# Altium schematic sheet Ethernet.SchDoc
size A4
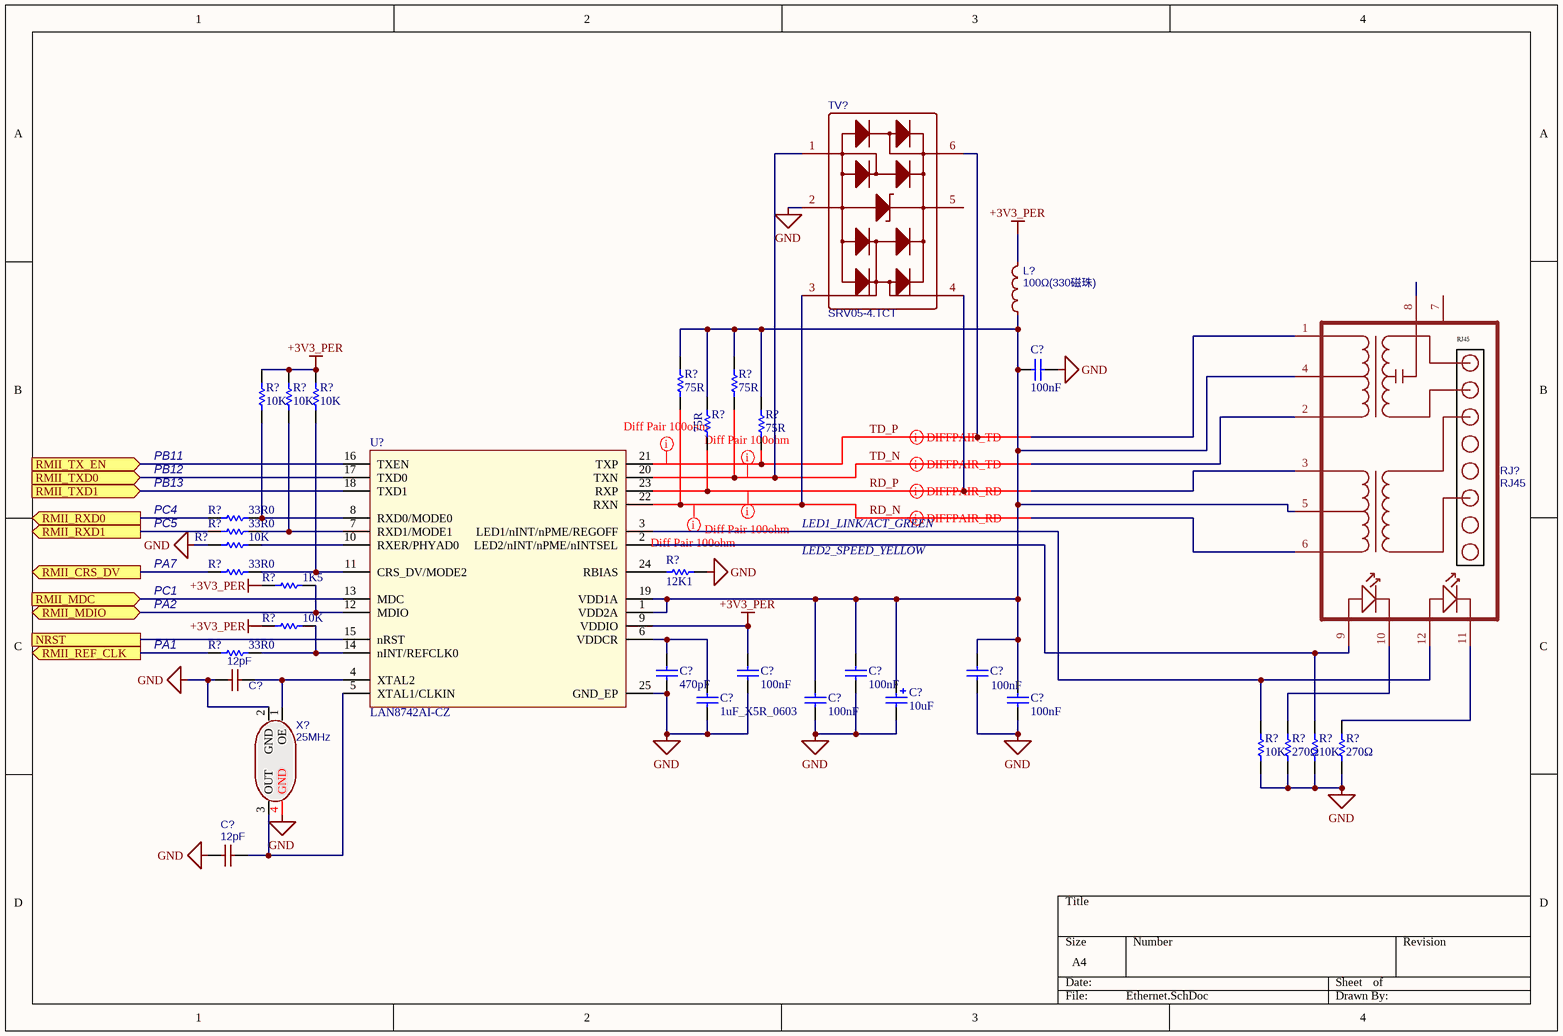
[diagram p0: Ethernet.SchDoc]

## Parts
(Parts that share a designator on the sheet are numbered #1, #2 ... from top to bottom, then left to right.)
C?#1  100nF  [0603 - cap]
C?#2  12pF  [0603 - cap]
C?#3  470pF  [0603 - cap]
C?#4  1uF_X5R_0603  [0603 - cap]
C?#5  100nF  [0603 - cap]
C?#6  100nF  [0603 - cap]
C?#7  100nF  [0603 - cap]
C?#8  10uF  [CASE-A_3216]
C?#9  100nF  [0603 - cap]
C?#10  100nF  [0603 - cap]
C?#11  12pF  [0603 - cap]
L?  100Ω(330磁珠)  [0805 - res]
R?#1  10K  [0603-res]
R?#2  10K  [0603-res]
R?#3  10K  [0603-res]
R?#4  75R  [0603-res]
R?#5  75R  [0603-res]
R?#6  75R  [0603-res]
R?#7  75R  [0603-res]
R?#8  33R0  [0603-res]
R?#9  33R0  [0603-res]
R?#10  10K  [0603-res]
R?#11  12K1  [0603-res]
R?#12  33R0  [0603-res]
R?#13  1K5  [0603-res]
R?#14  10K  [0603-res]
R?#15  33R0  [0603-res]
R?#16  10K  [0603-res]
R?#17  270Ω  [0603-res]
R?#18  10K  [0603-res]
R?#19  270Ω  [0603-res]
RJ?  RJ45  [RJ45]
TV?  SRV05-4.TCT  [SOT-23-6]
U?  LAN8742AI-CZ  [QFN-24_4X4X05P]
X?  25MHz  [OSC-YSX-3225_4P]

## Ports
NRST, RMII_CRS_DV (out), RMII_MDC (in), RMII_MDIO (bidir), RMII_REF_CLK (out), RMII_RXD0 (out), RMII_RXD1 (out), RMII_TX_EN (in), RMII_TXD0 (in), RMII_TXD1 (in)

## Nets
+3V3_PER: C?#5.2 L?.2 R?#1.1 R?#2.1 R?#3.1 R?#13.2 R?#14.1 U?.9(VDDIO)
GND: C?#1.1 C?#2.1 C?#3.1 C?#4.2 C?#5.1 C?#6.1 C?#7.1 C?#8.2 C?#9.1 C?#10.1 C?#11.1 R?#10.2 R?#11.2 R?#16.2 R?#17.2 R?#18.2 R?#19.2 TV?.2 U?.25(GND_EP) X?.2(GND) X?.4(GND)
NRST: U?.15(nRST) ; port NRST
RD_N: R?#4.1 RJ?.6 TV?.3 U?.22(RXN)
RD_P: R?#6.1 RJ?.3 TV?.4 U?.23(RXP)
RMII_CRS_DV: R?#12.2 ; port RMII_CRS_DV
RMII_MDC: U?.13(MDC) ; port RMII_MDC
RMII_MDIO: R?#13.1 U?.12(MDIO) ; port RMII_MDIO
RMII_REF_CLK: R?#15.2 ; port RMII_REF_CLK
RMII_RXD0: R?#8.2 ; port RMII_RXD0
RMII_RXD1: R?#9.2 ; port RMII_RXD1
RMII_TX_EN: U?.16(TXEN) ; port RMII_TX_EN
RMII_TXD0: U?.17(TXD0) ; port RMII_TXD0
RMII_TXD1: U?.18(TXD1) ; port RMII_TXD1
TD_N: R?#5.1 RJ?.2 TV?.1 U?.20(TXN)
TD_P: R?#7.1 RJ?.1 TV?.6 U?.21(TXP)
NetC?#1_2: C?#1.2 C?#6.2 C?#7.2 C?#8.1 C?#9.2 C?#10.2 L?.1 R?#4.2 R?#5.2 R?#6.2 R?#7.2 RJ?.4 RJ?.5 U?.1(VDD2A) U?.19(VDD1A)
NetC?#2_2: C?#2.2 U?.4(XTAL2) X?.1(OE)
NetC?#3_2: C?#3.2 C?#4.1 U?.6(VDDCR)
NetC?#11_2: C?#11.2 U?.5(XTAL1/CLKIN) X?.3(OUT)
NetR?#1_2: R?#1.2 R?#8.1 U?.8(RXD0/MODE0)
NetR?#2_2: R?#2.2 R?#9.1 U?.7(RXD1/MODE1)
NetR?#3_2: R?#3.2 R?#12.1 U?.11(CRS_DV/MODE2)
NetR?#10_1: R?#10.1 U?.10(RXER/PHYAD0)
NetR?#11_1: R?#11.1 U?.24(RBIAS)
NetR?#14_2: R?#14.2 R?#15.1 U?.14(nINT/REFCLK0)
NetR?#16_1: R?#16.1 RJ?.12 U?.3(LED1/nINT/nPME/REGOFF)
NetR?#17_1: R?#17.1 RJ?.10
NetR?#18_1: R?#18.1 RJ?.9 U?.2(LED2/nINT/nPME/nINTSEL)
NetR?#19_1: R?#19.1 RJ?.11

Not connected (* = marked no-connect by the designer): RJ? 7 8; TV? 5

## Layout directives
differential pair: RD_N, RD_P, TD_N, TD_P
rule Matched Net Lengths [Tolerance = 100mil]: RD_N, RD_P, TD_N, TD_P

## Notes on the sheet
- PB11
- PB12
- (near R?#8) PB13
- (near R?#8) PC4
- (near R?#8) PC5
- (near R?#12) PA7
- LED1_LINK/ACT_GREEN
- LED2_SPEED_YELLOW
- (near R?#12) PC1
- PA2
- PA1

## Library data of the parts
C?#1 C?#5-C?#7 C?#9 C?#10 = Capacitor_ST: Capacitor 0402 / 0603 / 0805; Revision: July-2002: Re-released for DXP Platform.; Value: 100nF
C?#2 C?#11 = (no symbol name): BOM_Manufacturer Part: CL10C120JB8NNNC; BOM_Manufacturer: SAMSUNG; nameAlias: Capacitance; BOM_Supplier: LCSC; BOM_LCSC: C38523; BOM_LCSC Assembly: Yes; spicePre: C; spiceSymbolName: CL10C120JB8NNNC
C?#3 = Capacitor_ST: Capacitor 0402 / 0603 / 0805; Value: 100nF; Revision: July-2002: Re-released for DXP Platform.
C?#4 = CAP SMD 0603  X5R 1礔 25V 10%: 0603  X5R 1礔; Rated voltage: 25V; Tolerance: 10%; Manufacturer: *; Manufacturer P/N: *; Order code Farnell: 1288202RL; Value: 1礔; Power: *; Technology: X5R; Temperature  Factor: *; Temperature Max: +125癈; Temperature Min: -55癈; STS Code: *
C?#8 = Cap_10uF_POL_10%_TANA: Polarized Capacitor,10uF,10V,10%,typeA,VISHAY; Manuf_Part_1: 293D106X9010A2TE3; Revision: July-2002: Re-released for DXP Platform.; Value: 10uF; Manuf_1: VISHAY; Order: *; ECCN_US/EU: n/a
L? = (no symbol name): BOM_Manufacturer: Chilisin; BOM_Manufacturer Part: PBY201209T-331Y-N; nameAlias: Value; Contributor: LCSC; BOM_Supplier: LCSC; BOM_LCSC: C142057; spicePre: L; spiceSymbolName: PBY201209T-331Y-N
R?#1-R?#3 R?#10 R?#14 R?#16 R?#18 = Resistor_ST: Resistor 0402 / 0603 / 0805; Value: 10K
R?#4-R?#7 = Res_50_1%_0603: Resistor,50,0603,1%,YAGEO; Manuf_Part_1: RC0402FR-0750RL; Value: 50; Manuf_1: YAGEO; Order: *; ECCN_US/EU: n/a; Distrib: FARNELL
R?#8 R?#9 R?#12 R?#15 = Res_33_1%_0402: Resistor,33,0402,1%,YAGEO; Manuf_Part_1: RC0402FR-0733RL; Value: 33; Manuf_1: YAGEO; Order: *; ECCN_US/EU: n/a; Distrib: FARNELL
R?#11 = Res_12K1_1%_0603: Resistor,12K1,0603,1%,VISHAY; Manuf_Part_1: MCT 0603-50 1% P5 12K1; Order: 2325243; Value: 12K1; ECCN_US/EU: n/a; Manuf_1: VISHAY; Distrib: FARNELL
R?#13 = Res_1K5_1%_0402: Resistor,1K5,0402,1%,YAGEO; Manuf_Part_1: RC0402FR-071K5L; Value: 1K5; Manuf_1: YAGEO; Order: RC0402FR-071K5L; ECCN_US/EU: n/a; Distrib: FARNELL
R?#17 R?#19 = Resistor_ST: Resistor 0402 / 0603 / 0805; Value: 10K
RJ? = (no symbol name): BOM_Manufacturer: LCSC; BOM_Supplier: LCSC; BOM_Manufacturer Part: RJ45; spicePre: R
TV? = (no symbol name): BOM_Manufacturer: SEMTECH; BOM_Supplier: LCSC; BOM_Manufacturer Part: SRV05-4.TCT; BOM_LCSC: C13612; image: //image.lceda.cn/szlcsc/C13612.jpg; spicePre: T
U? = LAN8742A-CZ-TR: LAN8742A-CZ-TR - Small Footprint RMII 10/100 Ethernet, Transceiver with HP Auto-MDIX and flexPWR Technology SQFN-24; Manuf_1: MICROCHIP; Order: LAN8742A-CZ-TR; Manuf_Part_1: LAN8742A-CZ-TR; Distrib: MICROCHIP
X? = (no symbol name): BOM_Manufacturer: YXC; BOM_Manufacturer Part: X322525MOB4SI; nameAlias: Frequency; BOM_Supplier: LCSC; BOM_LCSC: C9006; BOM_LCSC Assembly: Yes; spicePre: X; spiceSymbolName: X322525MOB4SI